# EAGLE design VFD Board V2 (EAGLE 9.1.3)
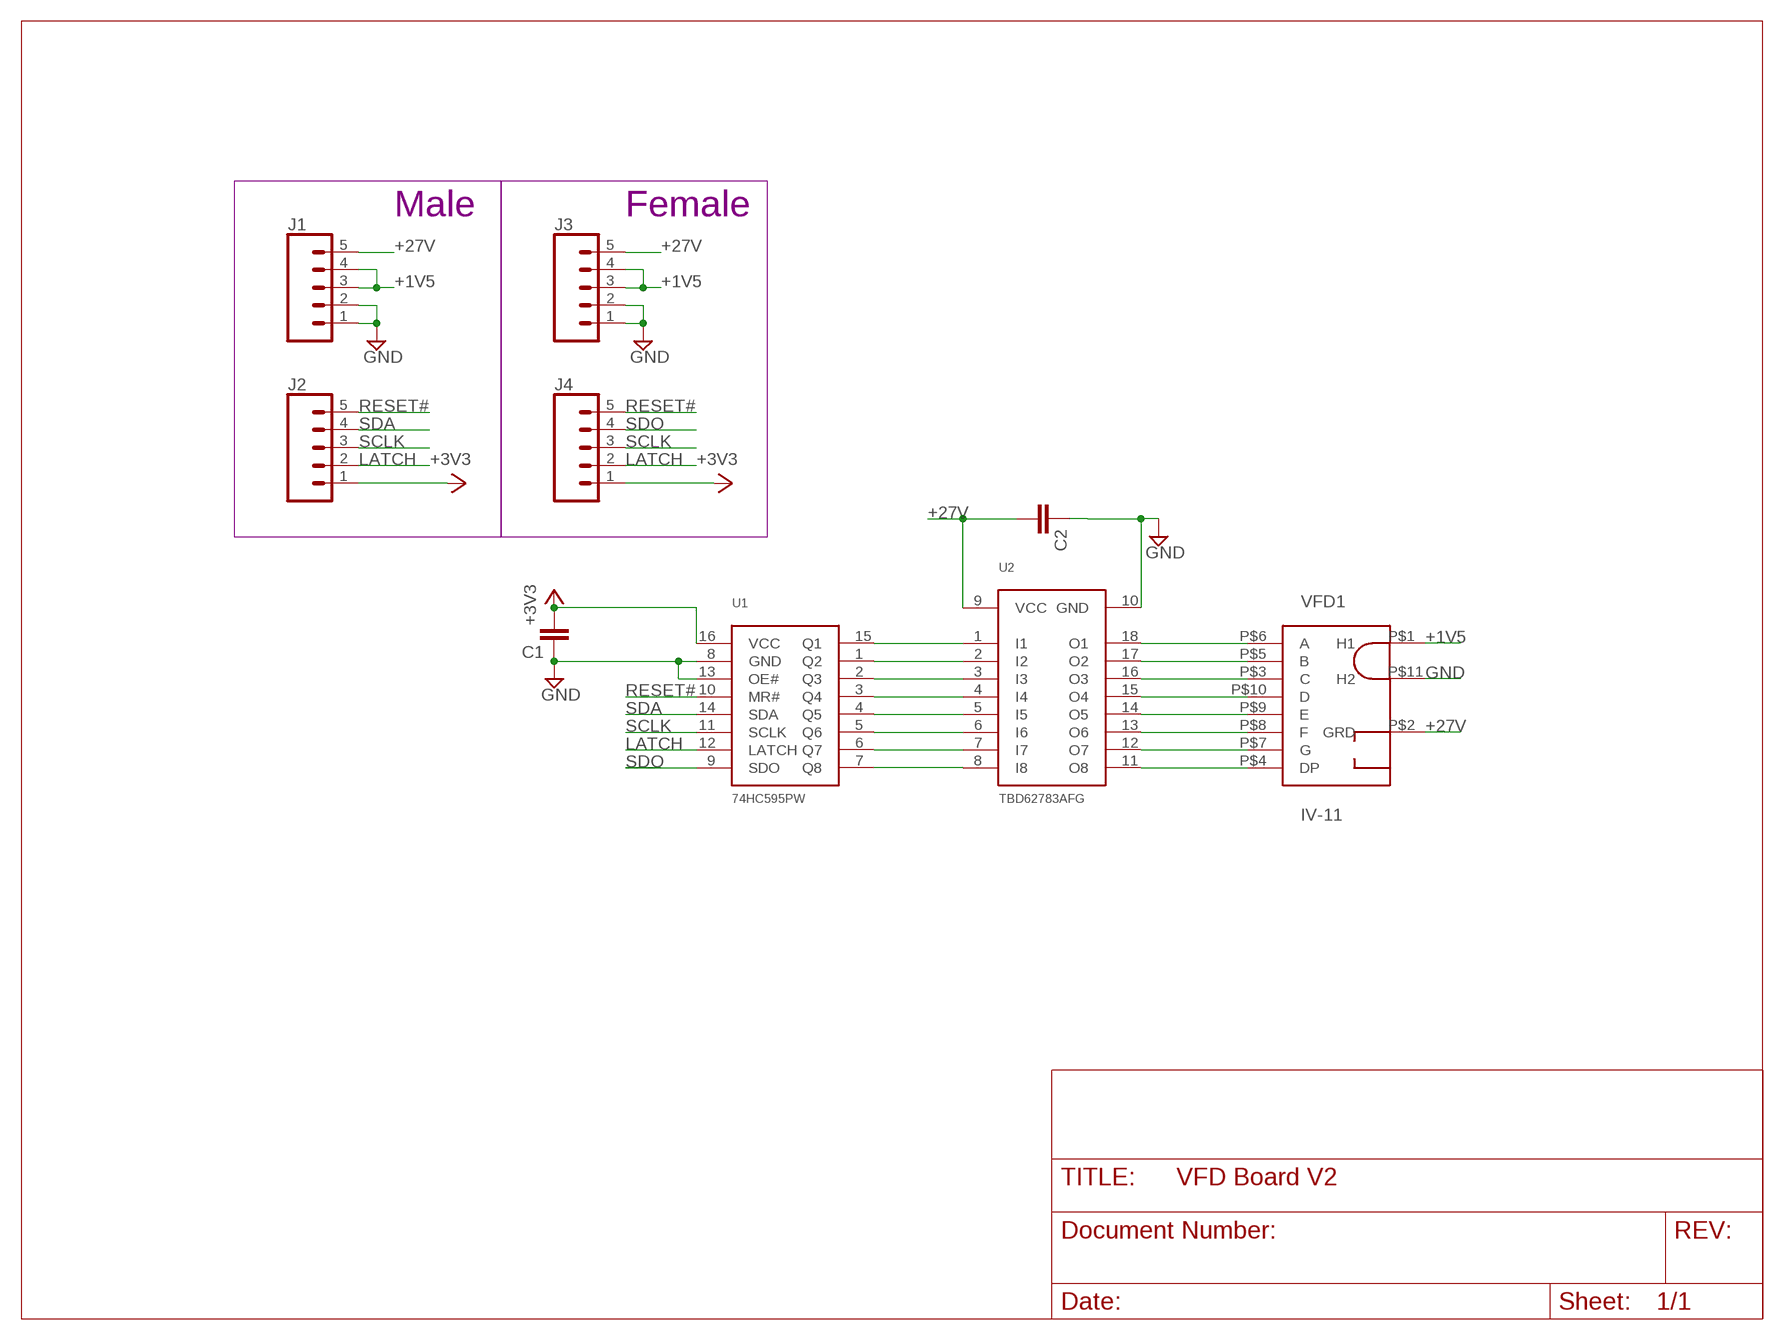
[diagram p0: schematic, sheet 1]

## Parts
C1  C-EUC0603  [C0603]
C2  C-EUC0603  [C0603]
J1  CONN_05NO_SILK  [1X05_NO_SILK]
J2  CONN_05NO_SILK  [1X05_NO_SILK]
J3  CONN_05NO_SILK  [1X05_NO_SILK]
J4  CONN_05NO_SILK  [1X05_NO_SILK]
U1  74HC595PW  [TSSOP16]
U2  TBD62783AFG  [SOIC18L]
VFD1  IV-11  [IV-11]

## Nets
+1V5: J1.3 J1.4 J3.3 J3.4 VFD1.P$1(H1)
+3V3: C1.2 J2.1 J4.1 U1.16(VCC)
+27V: C2.2 J1.5 J3.5 U2.9(VCC) VFD1.P$2(GRD)
GND: C1.1 C2.1 J1.1 J1.2 J3.1 J3.2 U1.8(GND) U1.13(OE#) U2.10(GND) VFD1.P$11(H2)
LATCH: J2.2 J4.2 U1.12(LATCH)
N$1: U2.18(O1) VFD1.P$6(A)
N$2: U1.7(Q8) U2.8(I8)
N$3: U1.6(Q7) U2.7(I7)
N$4: U1.5(Q6) U2.6(I6)
N$5: U1.4(Q5) U2.5(I5)
N$6: U1.3(Q4) U2.4(I4)
N$7: U1.2(Q3) U2.3(I3)
N$8: U1.1(Q2) U2.2(I2)
N$9: U1.15(Q1) U2.1(I1)
N$10: U2.17(O2) VFD1.P$5(B)
N$11: U2.16(O3) VFD1.P$3(C)
N$12: U2.15(O4) VFD1.P$10(D)
N$13: U2.14(O5) VFD1.P$9(E)
N$14: U2.13(O6) VFD1.P$8(F)
N$15: U2.12(O7) VFD1.P$7(G)
N$16: U2.11(O8) VFD1.P$4(DP)
RESET#: J2.5 J4.5 U1.10(MR#)
SCLK: J2.3 J4.3 U1.11(SCLK)
SDA: J2.4 U1.14(SDA)
SDO: J4.4 U1.9(SDO)

## Notes on the sheet
- Male | Female

## Library data of the parts
C1 C2 = rcl:C-EU: CAPACITOR, European symbol; SPICEPREFIX: C
J1-J4 = SparkFun-Connectors:CONN_05: Multi connection point. Often used as Generic Header-pin footprint for 0.1 inch spaced/style header connections On any of the 0.1 inch spaced packages, you can populate with these: Break Away Headers - Straight <https://www.sparkfun.com/products/116> (PRT-00116) Break Away Male Headers - Right Angle <https://www.sparkfun.com/products/553> (PRT-00553) Female Headers <https://www.sparkfun.com/products/115> (PRT-00115) Break Away Headers - Machine Pin <https://www.sparkfun.com/products/117> (PRT-00117) Break Away Female Headers - Swiss Machine Pin <https://www.sparkfun.com/products/743> (PRT-00743) For SCREWTERMINALS and SPRING TERMINALS visit here: Screw Terimnals on SparkFun.com <https://www.sparkfun.com/search/results?term=Screw+Terminals> (5mm/3.5mm/2.54mm spacing) This device is also useful as a general connection point to wire up your design to another part of your project. Our various solder wires solder well into these plated through hole pads. Hook-Up Wire - Assortment (Stranded, 22 AWG) <https://www.sparkfun.com/products/11375> (PRT-11375) Hook-Up Wire - Assortment (Solid Core, 22 AWG) <https://www.sparkfun.com/products/11367> (PRT-11367) View the entire wire category on our website here <https://www.sparkfun.com/categories/141> Special notes: Molex polarized connector foot print use with SKU : PRT-08231 with associated crimp pins and housings. 1MM SMD Version SKU: PRT-10208
U1 = Mason-IC's:74HC595PW: 8 Bit parallel out shift register with latched data outputs. Nexperia part. TSSOP package
U2 = Mason-IC's:TBD62783AFG: 50v Source driver. High Input > 2v (works with 3v3)
VFD1 = Mason-Display:IV-11

## Board
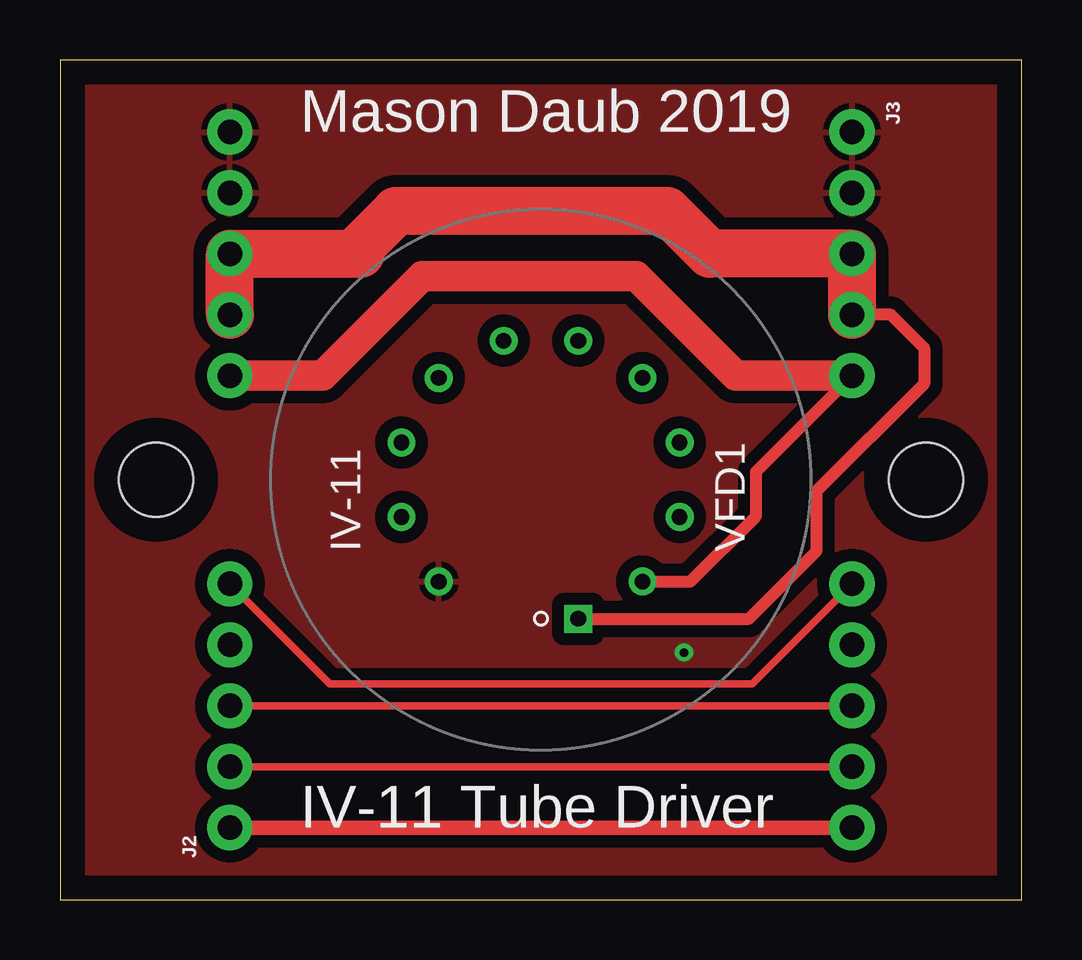
[diagram p1: board, top side]
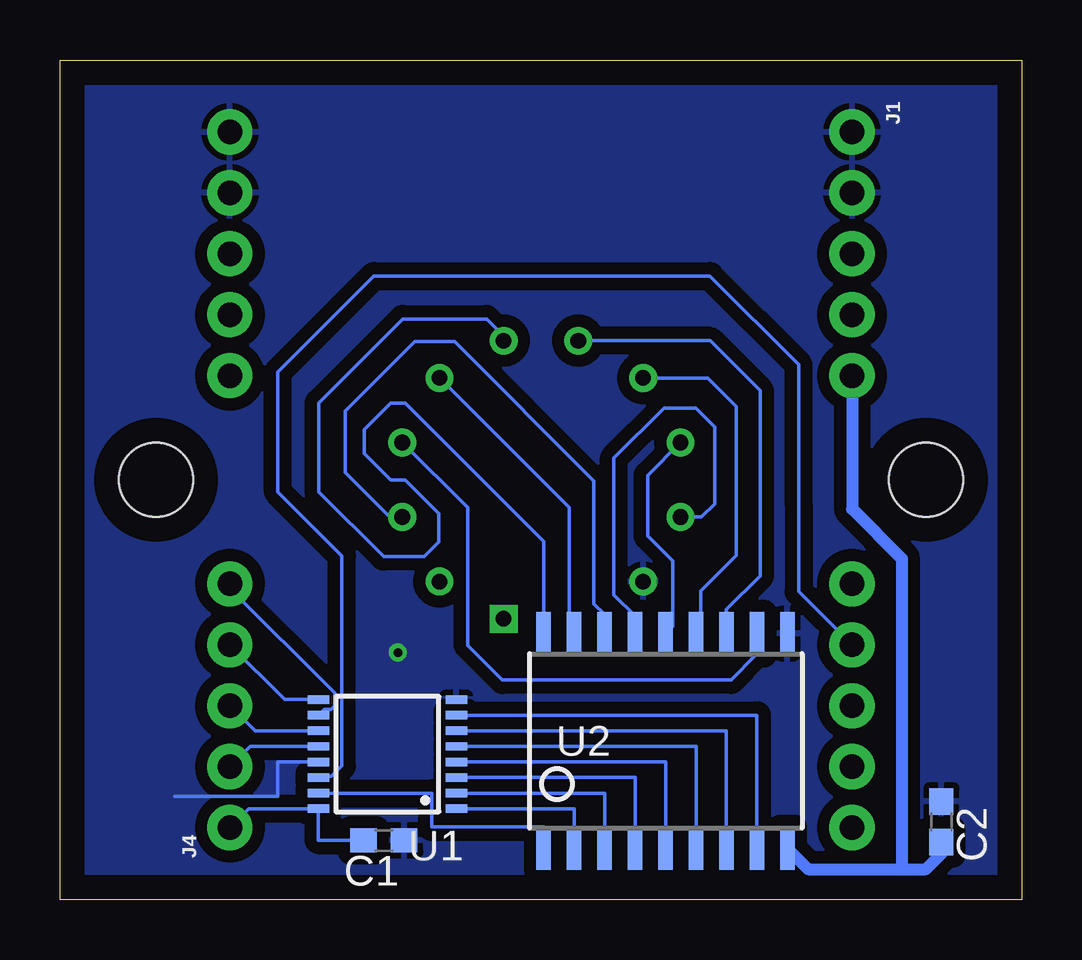
[diagram p2: board, bottom side, seen from below]

Size 40.08 x 35 mm. Coordinates in mm from the lower left corner, seen from the top.
Outline: 0,0 40.08,0 40.08,35 0,35 0,0
Copper layers (1*16): Top 0.035mm / dielectric 1.5mm / Bottom 0.035mm
Design rules "default *": minimum track width 6mil, minimum drill 0.35mm, track to track 20mil, track to pad 20mil, pad to pad 6mil, via to via 6mil, smd to smd 6mil, copper to edge 40mil, drill to drill 6mil, minimum pad ring 10mil, minimum via ring 8mil, stop-mask expansion 4mil, vias tented up to drill 0mil, thermal gap 10mil
Holes 3.1 mm at 4,17.5 36.08,17.5

### Footprints (pad centres in the part's own frame; a part is rotated, then mirrored left to right if it is on the bottom)
C0603 = smd 1.1 x 1: 1 -0.85,0; 2 0.85,0
1X05_NO_SILK = drill 1.016 pad 1.88: 1 0,0; 2 2.54,0; 3 5.08,0; 4 7.62,0; 5 10.16,0
TSSOP16 = smd 0.9 x 0.35: 1 -2.875,2.275; 2 -2.875,1.625; 3 -2.875,0.975; 4 -2.875,0.325; 5 -2.875,-0.325; 6 -2.875,-0.975; 7 -2.875,-1.625; 8 -2.875,-2.275; 9 2.875,-2.275; 10 2.875,-1.625; 11 2.875,-0.975; 12 2.875,-0.325; 13 2.875,0.325; 14 2.875,0.975; 15 2.875,1.625; 16 2.875,2.275
SOIC18L = smd 0.6 x 1.8: 1 -5.08,-4.475; 2 -3.81,-4.475; 3 -2.54,-4.475; 4 -1.27,-4.475; 5 0,-4.475; 6 1.27,-4.475; 7 2.54,-4.475; 8 3.81,-4.475; 9 5.08,-4.475; 10 5.08,4.475; 11 3.81,4.475; 12 2.54,4.475; 13 1.27,4.475; 14 0,4.475; 15 -1.27,4.475; 16 -2.54,4.475; 17 -3.81,4.475; 18 -5.08,4.475
IV-11 = drill 0.65 square: P$1 1.553,-5.796 | drill 0.65: P$2 4.227,-4.242; P$3 5.78,-1.552; P$4 5.779,1.554; P$5 4.227,4.243; P$6 1.553,5.796; P$7 -1.553,5.796; P$8 -4.258,4.243; P$9 -5.811,1.554; P$10 -5.811,-1.552; P$11 -4.259,-4.242

### Placement (x,y rotation side)
C1  26.59,2.47 180 bottom
C2  3.36,3.24 270 bottom
J1  7.08,32 270 bottom
J2  7.08,3 90 top
J3  33,32 270 top
J4  33,3 90 bottom
U1  26.44,6.06 180 bottom
U2  14.85,6.61 0 bottom
VFD1  20.04,17.5 0 top

### Tracks (layer width: path | path; a pad name or v marks a point on that pad's centre or on a via)
+1V5
  Top 0.508: J3.4 34.62,24.38 36,23 36,21.5 31.51,17.01 31.51,14.51 28.7,11.7 VFD1.P$1
  Top 2: J1.4 J1.3 12.52,26.92 12.27,26.97 14,28.7 25.3,28.7 27.08,26.92 J3.3 J3.4
+3V3
  Top 0.61: J2.1 J4.1
  Bottom 0.152: J4.1 32.22,3.79 U1.16 29.32,2.47 C1.2
+27V
  Top 0.508: VFD1.P$2 26.26,13.26 29,16 29,17.84 J3.5
  Top 1.27: J1.5 10.94,21.84 15.1,26 24,26 28.16,21.84 J3.5
  Bottom 0.508: U2.9 8.9,1.27 5,1.27 | 5,1.27 4,1.27 3.36,1.91 C2.2 | J1.5 7.08,16.28 5,14.2 5,1.27
GND  (via drill 0.35)
  Bottom 0.152: U1.13 31,5.74 31,4.3 35.3,4.3
  other vias: 26,10.3
  pour Bottom: 0,0 0,35 40,35 40,0
  pour Top: 0,35 40,35 40,0 0,0
LATCH
  Top 0.305: J2.2 J4.2
  Bottom 0.152: U1.12 32.16,6.38 J4.2
N$1
  Bottom 0.152: U2.18 19.93,14.93 25.7,20.7 26.3,20.7 27.4,19.6 27.4,18.6 26.3,17.5 25.7,17.5 24.3,16.1 24.3,14.9 24.9,14.3 26.6,14.3 29.3,17 29.3,20.7 25.8,24.2 22.3,24.2 21.59,23.49 VFD1.P$6
N$2
  Bottom 0.152: U1.7 11.04,7.68 U2.8
N$3
  Bottom 0.152: U2.7 12.31,7.04 U1.6
N$4
  Bottom 0.152: U1.5 13.58,6.38 U2.6
N$5
  Bottom 0.152: U1.4 14.85,5.74 U2.5
N$6
  Bottom 0.152: U1.3 16.12,5.08 U2.4
N$7
  Bottom 0.152: U1.2 17.39,4.43 U2.3
N$8
  Bottom 0.152: U1.1 18.66,3.79 U2.2
N$9
  Bottom 0.152: 19.93,2.9 U2.1 19.93,3.03 24.6,3.03 24.6,4.43 U1.15
N$10
  Bottom 0.152: VFD1.P$5 18.86,16.34 18.86,11.29 U2.17
N$11
  Bottom 0.152: VFD1.P$3 26.34,15.95 28.19,17.8 28.19,20.37 25.3,23.25 23.63,23.25 17.83,17.45 17.83,12.33 17.39,11.88 U2.16
N$12
  Bottom 0.152: U2.15 16.12,11.82 17,12.7 17,18.4 14.9,20.5 13.6,20.5 12.8,19.7 12.8,16.5 13.35,15.95 VFD1.P$10
N$13
  Bottom 0.152: VFD1.P$9 15.6,17.69 15.6,15.15 14.55,14.11 14.55,11.38 U2.14
N$14
  Bottom 0.152: VFD1.P$8 13.09,21.74 11.91,20.56 11.91,14.34 13.38,12.87 13.38,11.29 U2.13
N$15
  Bottom 0.152: VFD1.P$7 13,23.3 10.91,21.21 10.91,13.48 12.31,12.09 U2.12
N$16
  Bottom 0.152: U2.11 11.08,11.04 11.08,10.19 12.12,9.15 21.65,9.15 23.1,10.6 23.1,16.33 VFD1.P$4
RESET#
  Top 0.305: J4.5 28.84,9 11.24,9 J2.5
  Bottom 0.152: U1.10 29.07,7.93 28.77,7.93 28.64,8.06 28.64,8.61 33,12.97 J4.5
SCLK
  Top 0.305: J2.3 J4.3
  Bottom 0.152: U1.11 31.95,7.04 J4.3
SDA
  Bottom 0.152: U1.14 29.27,5.13 28.77,5.13 28.33,5.57 28.33,14.33 31,17 31,22 27,26 13,26 9.3,22.3 9.3,16.5 9.3,12.84 J2.4
SDO
  Bottom 0.152: U1.9 30.71,8.34 J4.4

### Text on the board
tNames: Mason Daub 2019 | IV-11 Tube Driver